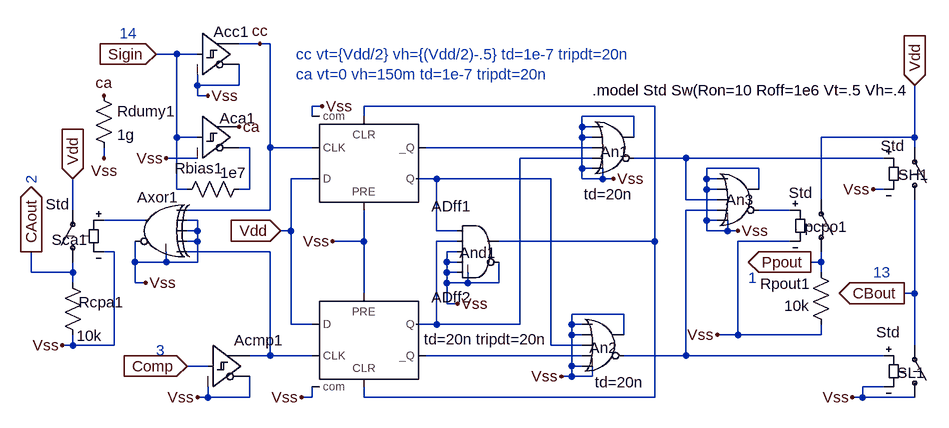
[diagram p0: schematic x46DetFase.asc]
x46DetFase.asc, the LTspice schematic file:
Version 4
SHEET 1 1288 880
WIRE -528 384 -528 352
WIRE -464 288 -464 240
WIRE -464 384 -528 384
WIRE -464 384 -464 368
WIRE -464 400 -464 384
WIRE -464 496 -480 496
WIRE -464 496 -464 480
WIRE -416 208 -416 192
WIRE -400 352 -416 352
WIRE -400 496 -464 496
WIRE -400 496 -400 352
WIRE -368 368 -368 336
WIRE -368 400 -368 368
WIRE -352 304 -416 304
WIRE -352 400 -368 400
WIRE -320 368 -368 368
WIRE -320 368 -320 352
WIRE -304 48 -336 48
WIRE -304 176 -304 48
WIRE -304 256 -304 176
WIRE -288 256 -304 256
WIRE -272 48 -304 48
WIRE -272 96 -272 80
WIRE -272 112 -272 96
WIRE -272 176 -304 176
WIRE -272 208 -320 208
WIRE -272 304 -288 304
WIRE -272 320 -288 320
WIRE -272 320 -272 304
WIRE -272 336 -288 336
WIRE -272 336 -272 320
WIRE -272 368 -320 368
WIRE -272 368 -272 336
WIRE -256 112 -272 112
WIRE -256 528 -288 528
WIRE -256 576 -272 576
WIRE -256 576 -256 560
WIRE -208 96 -272 96
WIRE -208 96 -208 64
WIRE -192 192 -208 192
WIRE -192 256 -208 256
WIRE -192 256 -192 192
WIRE -192 576 -256 576
WIRE -192 576 -192 544
WIRE -176 32 -208 32
WIRE -160 32 -176 32
WIRE -160 192 -160 32
WIRE -160 288 -288 288
WIRE -160 288 -160 192
WIRE -160 352 -288 352
WIRE -160 512 -192 512
WIRE -160 512 -160 352
WIRE -128 320 -144 320
WIRE -128 320 -128 240
WIRE -128 464 -128 320
WIRE -96 144 -96 128
WIRE -96 192 -160 192
WIRE -96 240 -128 240
WIRE -96 464 -128 464
WIRE -96 512 -160 512
WIRE -96 576 -112 576
WIRE -96 576 -96 560
WIRE -80 128 -96 128
WIRE -16 144 -16 128
WIRE -16 336 -64 336
WIRE -16 336 -16 288
WIRE -16 416 -16 336
WIRE -16 576 -16 560
WIRE 96 240 64 240
WIRE 96 320 96 240
WIRE 96 464 64 464
WIRE 96 464 96 336
WIRE 112 368 112 352
WIRE 112 384 112 368
WIRE 112 400 112 384
WIRE 112 432 112 400
WIRE 128 320 96 320
WIRE 128 336 96 336
WIRE 128 352 112 352
WIRE 128 368 112 368
WIRE 128 384 112 384
WIRE 128 432 112 432
WIRE 144 400 112 400
WIRE 144 400 144 384
WIRE 192 400 144 400
WIRE 192 400 192 368
WIRE 224 464 96 464
WIRE 224 464 224 208
WIRE 272 240 96 240
WIRE 272 496 272 240
WIRE 304 464 304 448
WIRE 304 480 304 464
WIRE 304 528 304 480
WIRE 304 544 288 544
WIRE 304 544 304 528
WIRE 320 160 320 144
WIRE 320 176 320 160
WIRE 320 224 320 176
WIRE 320 240 320 224
WIRE 320 464 304 464
WIRE 320 480 304 480
WIRE 320 496 272 496
WIRE 320 512 80 512
WIRE 320 528 304 528
WIRE 336 160 320 160
WIRE 336 176 320 176
WIRE 336 192 80 192
WIRE 336 208 224 208
WIRE 336 224 320 224
WIRE 336 544 304 544
WIRE 336 544 336 528
WIRE 352 240 320 240
WIRE 352 240 352 224
WIRE 368 240 352 240
WIRE 384 448 304 448
WIRE 384 480 384 448
WIRE 400 144 320 144
WIRE 400 176 400 144
WIRE 432 128 -16 128
WIRE 432 336 192 336
WIRE 432 336 432 128
WIRE 432 576 -16 576
WIRE 432 576 432 336
WIRE 480 208 400 208
WIRE 480 272 480 208
WIRE 480 512 384 512
WIRE 480 512 480 288
WIRE 512 240 512 224
WIRE 512 256 512 240
WIRE 512 304 512 256
WIRE 512 320 512 304
WIRE 528 240 512 240
WIRE 528 256 512 256
WIRE 528 272 480 272
WIRE 528 288 480 288
WIRE 528 304 512 304
WIRE 544 320 512 320
WIRE 544 320 544 304
WIRE 560 320 544 320
WIRE 560 480 528 480
WIRE 560 480 560 336
WIRE 592 224 512 224
WIRE 592 256 592 224
WIRE 640 288 592 288
WIRE 640 336 560 336
WIRE 688 272 688 176
WIRE 688 368 672 368
WIRE 688 368 688 352
WIRE 688 384 688 368
WIRE 688 480 560 480
WIRE 688 480 688 464
WIRE 752 576 736 576
WIRE 752 576 752 560
WIRE 784 208 480 208
WIRE 784 256 768 256
WIRE 784 512 480 512
WIRE 784 560 752 560
WIRE 832 176 688 176
WIRE 832 176 832 96
WIRE 832 192 832 176
WIRE 832 416 816 416
WIRE 832 416 832 272
WIRE 832 496 832 416
WIRE 832 576 752 576
FLAG -144 320 Vdd
IOPIN -144 320 In
FLAG -288 528 Comp
IOPIN -288 528 In
FLAG 672 368 Ppout
IOPIN 672 368 Out
FLAG 832 96 Vdd
IOPIN 832 96 In
FLAG 816 416 CBout
IOPIN 816 416 Out
FLAG -528 352 CAout
IOPIN -528 352 Out
FLAG -464 240 Vdd
IOPIN -464 240 In
FLAG -336 48 Sigin
IOPIN -336 48 In
FLAG -208 160 ca
FLAG -176 32 cc
FLAG -272 576 Vss
FLAG -112 576 Vss
FLAG 288 544 Vss
FLAG 528 480 Vss
FLAG 736 576 Vss
FLAG -480 496 Vss
FLAG -352 400 Vss
FLAG -64 336 Vss
FLAG -80 128 Vss
FLAG -256 112 Vss
FLAG -320 208 Vss
FLAG 128 432 Vss
FLAG 368 240 Vss
FLAG 560 320 Vss
FLAG 768 256 Vss
FLAG -416 208 Vss
FLAG -416 112 ca
SYMBOL Digital\\dflop -16 288 M180
SYMATTR InstName ADff1
SYMBOL Digital\\dflop -16 416 R0
SYMATTR InstName ADff2
SYMBOL Digital\\or 368 128 R0
WINDOW 0 -20 70 Left 0
WINDOW 3 -45 136 Left 0
SYMATTR InstName An1
SYMATTR Value td=20n
SYMBOL Digital\\or 352 432 R0
WINDOW 0 -21 68 Left 0
WINDOW 3 -12 121 Left 0
SYMATTR InstName An2
SYMATTR Value td=20n
SYMBOL Digital\\xor -336 256 M0
WINDOW 0 -34 12 Left 0
SYMATTR InstName Axor1
SYMBOL Digital\\or 560 208 R0
WINDOW 0 -19 64 Left 0
SYMATTR InstName An3
SYMBOL Digital\\and 160 288 R0
WINDOW 0 -29 66 Left 0
WINDOW 3 -83 199 Left 0
SYMATTR InstName And1
SYMATTR Value td=20n tripdt=20n
SYMBOL sw 832 288 M180
WINDOW 0 -25 54 Left 0
WINDOW 3 -52 99 Left 0
SYMATTR InstName SH1
SYMATTR Value Std
SYMBOL sw 832 592 M180
WINDOW 0 -27 54 Left 0
WINDOW 3 -59 116 Left 0
SYMATTR InstName SL1
SYMATTR Value Std
SYMBOL sw 688 368 M180
WINDOW 0 -25 54 Left 0
WINDOW 3 -50 107 Left 0
SYMATTR InstName pcpo1
SYMATTR Value Std
SYMBOL res 704 480 R180
WINDOW 0 32 79 Left 0
WINDOW 3 34 45 Left 0
SYMATTR InstName Rpout1
SYMATTR Value 10k
SYMBOL sw -464 384 R180
WINDOW 0 -22 50 Left 0
WINDOW 3 6 105 Left 0
SYMATTR InstName Sca1
SYMATTR Value Std
SYMBOL res -480 384 R0
WINDOW 0 25 46 Left 0
WINDOW 3 22 97 Left 0
SYMATTR InstName Rcpa1
SYMATTR Value 10k
SYMBOL Digital\\schmitt -256 464 R0
WINDOW 3 -256 140 Invisible 0
SYMATTR Value vt={Vdd/2} vh={(Vdd/2)-.5} td=20n tripdt=50n
SYMATTR InstName Acmp1
SYMBOL Digital\\schmitt -272 112 R0
WINDOW 3 -181 102 Invisible 0
WINDOW 0 34 35 Left 0
SYMATTR Value vt=0 vh=150m td=20n tripdt=50n
SYMATTR InstName Aca1
SYMBOL Digital\\schmitt -272 -16 R0
WINDOW 3 129 35 Invisible 0
WINDOW 0 25 30 Left 0
SYMATTR Value vt={Vdd/2} vh={(Vdd/2)-.5} td=20n tripdt=50n
SYMATTR InstName Acc1
SYMBOL res -192 240 R90
WINDOW 0 -1 78 VBottom 0
WINDOW 3 -25 25 VTop 0
SYMATTR InstName Rbias1
SYMATTR Value 1e7
SYMBOL res -432 96 R0
SYMATTR InstName Rdumy1
SYMATTR Value 1g
TEXT -392 16 Left 0 ;14
TEXT -336 504 Left 0 ;3
TEXT -528 248 VLeft 0 ;2
TEXT 768 384 Left 0 ;13
TEXT 576 392 Left 0 ;1
TEXT 336 104 Left 0 !.model Std Sw(Ron=10 Roff=1e6 Vt=.5 Vh=.4
TEXT -120 48 Left 0 ;cc vt={Vdd/2} vh={(Vdd/2)-.5} td=1e-7 tripdt=20n\nca vt=0 vh=150m td=1e-7 tripdt=20n

The netlist it stands for:
* x46DetFase.asc
ADff1 Vdd Vss cc Vss N004 N008 N005 Vss DFLOP
ADff2 Vdd Vss N003 Vss N004 N007 N006 Vss DFLOP
An1 Vss Vss N008 N006 Vss N009 Vss Vss OR td=20n
An2 Vss Vss N005 N007 Vss N010 Vss Vss OR td=20n
Axor1 cc Vss Vss Vss N003 Vss N001 Vss XOR
An3 Vss Vss N009 N010 Vss N011 Vss Vss OR
And1 N005 N006 Vss Vss Vss Vss N004 Vss AND td=20n tripdt=20n
SH1 CBout Vdd N009 Vss Std
SL1 Vss CBout N010 Vss Std
S§pcpo1 Ppout Vdd N011 Vss Std
Rpout1 Vss Ppout 10k
Sca1 CAout Vdd N001 Vss Std
Rcpa1 CAout Vss 10k
Acmp1 Comp Vss Vss Vss Vss Vss N003 Vss SCHMITT vt={Vdd/2} vh={(Vdd/2)-.5} td=20n tripdt=50n
Aca1 Sigin Vss Vss Vss Vss N002 ca Vss SCHMITT vt=0 vh=150m td=20n tripdt=50n
Acc1 Sigin Vss Vss Vss Vss Vss cc Vss SCHMITT vt={Vdd/2} vh={(Vdd/2)-.5} td=20n tripdt=50n
Rbias1 N002 Sigin 1e7
Rdumy1 ca Vss 1g
* 14
* 3
* 2
* 13
* 1
.model Std Sw(Ron=10 Roff=1e6 Vt=.5 Vh=.4
* cc vt={Vdd/2} vh={(Vdd/2)-.5} td=1e-7 tripdt=20n
* ca vt=0 vh=150m td=1e-7 tripdt=20n
.backanno
.end